# EAGLE design current_measure (EAGLE 6.4)
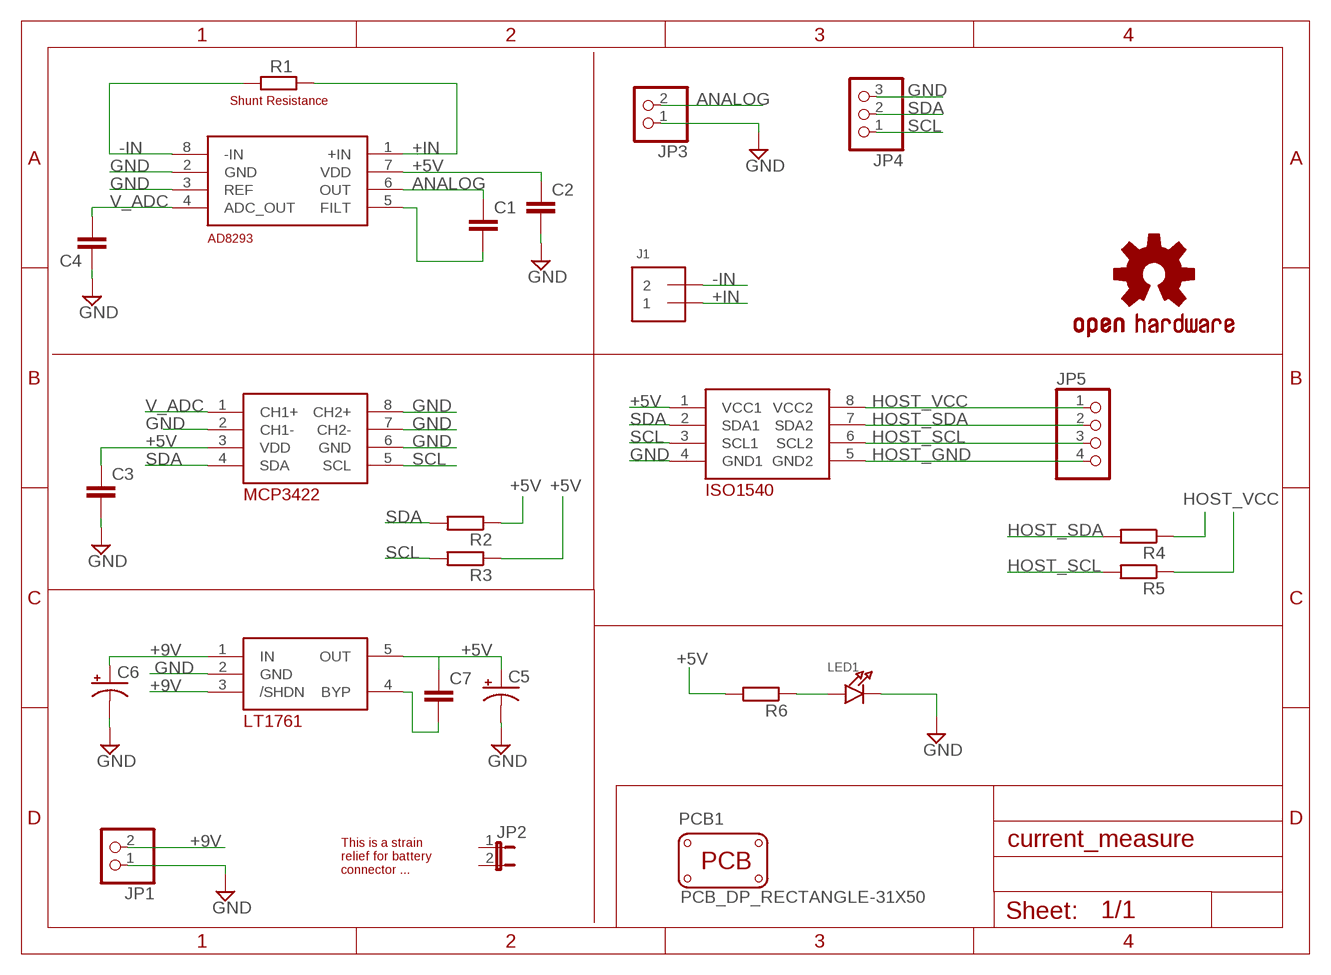
[diagram p0: schematic, sheet 1]

## Parts
C1  C-EUC0603  [C0603]
C2  C-EUC0603  [C0603]
C3  C-EUC0603  [C0603]
C4  C-EUC0603  [C0603]
C5  CPOL-USC/6032-28R  [C/6032-28R]
C6  CPOL-USC/6032-28R  [C/6032-28R]
C7  C-EUC0603  [C0603]
J1  TERMBLOCK_1X2  [TERMBLOCK_1X2-3.5MM]
JP1  PINHD-1X2  [1X02]
JP2  JUMPER2  [JUMPER2]
JP3  PINHD-1X2  [1X02]
JP4  HEADER-1X3ROUND  [1X03_ROUND]
JP5  HEADER-1X4ROUND  [1X04_ROUND]
LED1  LED0805_NOOUTLINE  [CHIPLED_0805_NOOUTLINE]
LOGO1  OSHW-LOGOM  [OSHW-LOGO-M]
PCB1  PCB_DP_RECTANGLE-31X50  [DP5031_V1]
R1  R-EU_R1206  [R1206]
R2  R-EU_R0603  [R0603]
R3  R-EU_R0603  [R0603]
R4  R-EU_R0603  [R0603]
R5  R-EU_R0603  [R0603]
R6  R-EU_R0603  [R0603]
U$1  IHSAN_AD8293  [SOT23-8]
U$2  IHSAN_MCP3422  [SO08]
U$3  IHSAN_LT1761  [SOT23-5]
U$4  IHSAN_ISO1540  [SO08]

## Nets
+5V: C2.1 C3.1 C5.+ C7.1 R2.1 R3.1 R6.2 U$1.7(VDD) U$2.3(VDD) U$3.5(OUT) U$4.1(VCC1)
+9V: C6.+ JP1.2 U$3.1(IN) U$3.3(/SHDN)
+IN: J1.1 R1.2 U$1.1(+IN)
-IN: J1.2 R1.1 U$1.8(-IN)
ANALOG: C1.1 JP3.2 U$1.6(OUT)
GND: C2.2 C3.2 C4.1 C5.- C6.- JP1.1 JP3.1 JP4.3 LED1.C U$1.2(GND) U$1.3(REF) U$2.2(CH1-) U$2.6(GND) U$2.7(CH2-) U$2.8(CH2+) U$3.2(GND) U$4.4(GND1)
HOST_GND: JP5.4 U$4.5(GND2)
HOST_SCL: JP5.3 R5.2 U$4.6(SCL2)
HOST_SDA: JP5.2 R4.2 U$4.7(SDA2)
HOST_VCC: JP5.1 R4.1 R5.1 U$4.8(VCC2)
N$1: LED1.A R6.1
N$2: C7.2 U$3.4(BYP)
N$4: C1.2 U$1.5(FILT)
SCL: JP4.1 R3.2 U$2.5(SCL) U$4.3(SCL1)
SDA: JP4.2 R2.2 U$2.4(SDA) U$4.2(SDA1)
V_ADC: C4.2 U$1.4(ADC_OUT) U$2.1(CH1+)
Unconnected: JP2.1 JP2.2

## Notes on the sheet
- Shunt Resistance
- This is a strain
  relief for battery
  connector ...

## Library data of the parts
C1-C4 C7 = rcl:C-EU: CAPACITOR, European symbol
C5 C6 = rcl:CPOL-US: POLARIZED CAPACITOR, American symbol
J1 = microbuilder:TERMBLOCK_1X2: 3.5mm Terminal block http://www.ladyada.net/library/pcb/eaglelibrary.html
JP1 JP3 = pinhead:PINHD-1X2: PIN HEADER
JP2 = microbuilder:JUMPER2: JUMPER - 2 Pins
JP4 = microbuilder:HEADER-1X3: PIN HEADER
JP5 = microbuilder:HEADER-1X4: PIN HEADER
LED1 = microbuilder:LED: LED 0603 - 0603 Surface Mount Package 2mA: Green LED - Low Power (3.9mcd, 2ma, 1.7Vf) - Digikey: 475-2709-2-ND Orange LED - Low Power (9.8mcd, 2ma, 1.8Vf) - Digikey: 475-1194-2-ND Red LED - Low Power (5mcd, 2ma, 1.8Vf) - Digikey: 475-1195-2-ND Yellow LED - Low Power (7mcd, 2ma, 1.8Vf) - Digikey: 475-1196-2-ND 5mA: Blue LED - Low Power (17mcd, 5ma, 2.9Vf) - Digikey: LNJ937W8CRACT-ND 0805 - 0805 Surface Mount Package 2mA: Red LED (8.8mcd, 2mA, 1.8Vf, Clear) - Low Power [Digikey: 475-2510-1-ND] Green LED (5mcd, 2mA, 1.8Vf, Clear) - Low Power [Digikey: 475-2730-1-ND] Yellow LED (11.3mcd, 2mA, 1.8Vf, Clear) - Low Power [Digikey: 475-2555-1-ND] 20mA: Red LED (104mcd, 20mA, Diffused) - LS R976 [Digikey: 475-1278-6-ND] Red LED (12mcd, 20mA, 2.0Vf, Clear) - APT2012EC [Digikey: 754-1128-1-ND] Green LED (15mcd, 20mA, 2.2Vf, Clear) - APT2012GC [Digikey: 754-1131-1-ND] Orange LED (160mcd, 20mA, 2.1Vf, Clear) - APT2012SECK [Digikey: 754-1130-1-ND] 1206 - 1206 Surface Mount Package Green LED (26mcd, 20mA, Diffused) - LG N971 [Digikey: 475-1407-6-ND] Red LED (15mcd, 20mA, Diffused) - LH N974 [Digikey: 475-1416-6-ND]
LOGO1 = SparkFun-Aesthetics:OSHW-LOGO: Open Source Hardware Logo This logo indicates the piece of hardware it is found on incorporates a OSHW license and/or adheres to the definition of open source hardware found here: http://freedomdefined.org/OSHW
PCB1 = dp_devices:PCB_DP_RECTANGLE: Dangerous Prototypes Standard Rectangular PCB sizes
R1-R6 = rcl:R-EU_: RESISTOR, European symbol
U$1 = SparkFun-DigitalIC:IHSAN_AD8293
U$2 = SparkFun-DigitalIC:IHSAN_MCP3422
U$3 = SparkFun-DigitalIC:IHSAN_LT1761
U$4 = SparkFun-DigitalIC:IHSAN_ISO1540

## Board
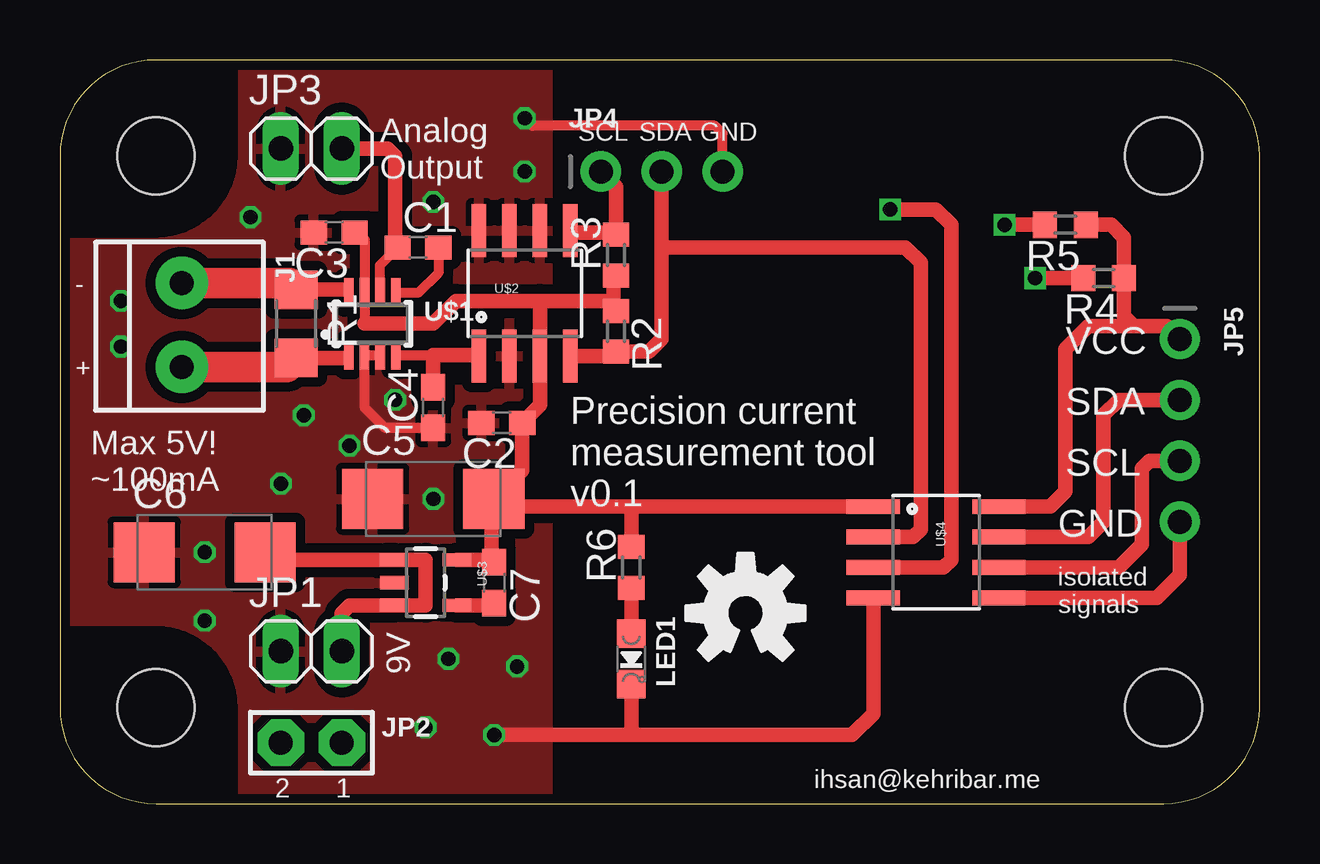
[diagram p1: board, top side]
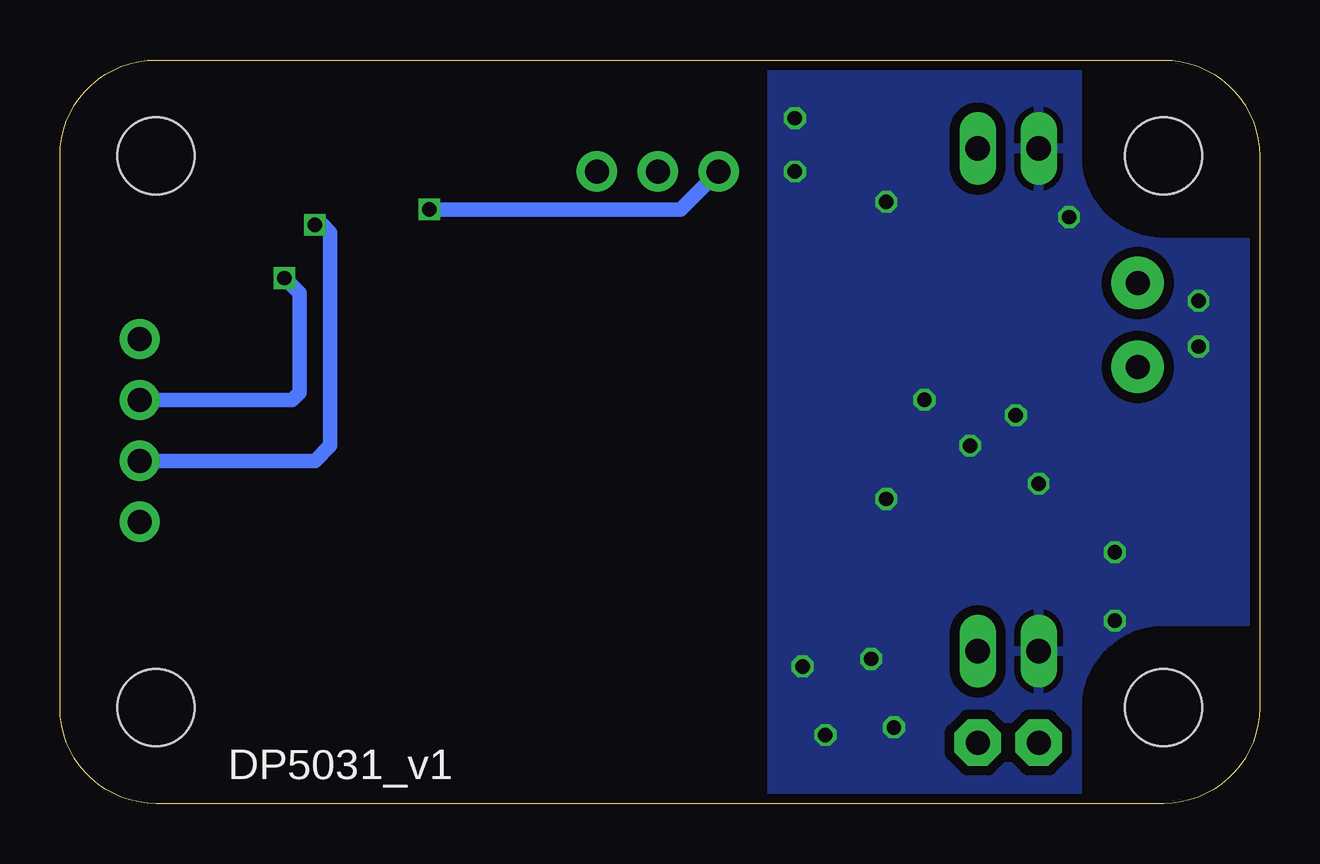
[diagram p2: board, bottom side, seen from below]

Size 50 x 31 mm. Coordinates in mm from the lower left corner, seen from the top.
Copper layers (1*16): Top 0.035mm / dielectric 1.5mm / Bottom 0.035mm
Design rules "Fusion_eagle_rule_v1.1": minimum track width 6mil, minimum drill 12mil, track to track 6mil, track to pad 6mil, pad to pad 6mil, via to via 6mil, smd to smd 0mil, copper to edge 10mil, drill to drill 10mil, minimum pad ring 10mil, minimum via ring 6mil, stop-mask expansion 2mil, vias tented up to drill 100mil, thermal gap 10mil

### Footprints (pad centres in the part's own frame; a part is rotated, then mirrored left to right if it is on the bottom)
C0603 = smd 1.1 x 1: 1 -0.85,0; 2 0.85,0
C/6032-28R = smd 2.55 x 2.5: + 2.525,0; - -2.525,0
TERMBLOCK_1X2-3.5MM = drill 1 pad 2.184: 1 1.8,0; 2 -1.7,0
1X02 = drill 1.016 long: 1 -1.27,0; 2 1.27,0
JUMPER2 = drill 1 pad 1.93 octagon: 1 2.54,0; 2 0,0
1X03_ROUND = drill 1 pad 1.676: 1 -2.54,0; 2 0,0; 3 2.54,0
1X04_ROUND = drill 1 pad 1.676: 1 -3.81,0; 2 -1.27,0; 3 1.27,0; 4 3.81,0
CHIPLED_0805_NOOUTLINE = smd 1.2 x 1.2: A 0,-1.05; C 0,1.05
DP5031_V1 = hole 3.2: 4,4; 46,4; 46,27; 4,27
R1206 = smd 1.6 x 1.803: 1 -1.422,0; 2 1.422,0
R0603 = smd 1 x 1.1: 1 -0.85,0; 2 0.85,0
SOT23-8 = smd 0.4 x 1.2: 1 -0.975,-1.3; 2 -0.325,-1.3; 3 0.325,-1.3; 4 0.975,-1.3; 5 0.975,1.3; 6 0.325,1.3; 7 -0.325,1.3; 8 -0.975,1.3
SO08 = smd 0.61 x 2.21: 1 -1.905,-2.616; 2 -0.635,-2.616; 3 0.635,-2.616; 4 1.905,-2.616; 5 1.905,2.616; 6 0.635,2.616; 7 -0.635,2.616; 8 -1.905,2.616
SOT23-5 = smd 0.55 x 1.2: 1 -0.95,-1.3; 2 0,-1.3; 3 0.95,-1.3; 4 0.95,1.3; 5 -0.95,1.3

### Placement (x,y rotation side)
C1  14.92,23.18 0 top
C2  18.41,15.88 180 top
C3  11.43,23.81 180 top
C4  15.56,16.51 90 top
C5  15.56,12.7 0 top
C6  6.03,10.48 0 top
C7  18.1,9.21 270 top
J1  5.08,20 270 top
JP1  10.48,6.35 0 top
JP2  9.21,2.54 0 top
JP3  10.48,27.3 0 top
JP4  25.08,26.35 0 top
JP5  46.67,15.56 270 top
LED1  23.81,6.03 180 top
LOGO1  28.57,7.94 0 top
PCB1  0,0 0 top
R1  9.84,20 270 top
R2  23.18,19.68 270 top
R3  23.18,22.86 90 top
R4  43.5,21.91 180 top
R5  41.91,24.13 180 top
R6  23.81,9.84 90 top
U$1  13.02,20 0 top
U$2  19.37,21.27 0 top
U$3  15.24,9.21 270 top
U$4  36.51,10.48 270 top

### Tracks (layer width: path | path; a pad name or v marks a point on that pad's centre or on a via)
+5V
  Top 0.406: 12.69,20.01 U$1.7 12.7,23.5 12.38,23.81 C3.1 | 18,10.16 C7.1 | 18,12.62 C5.+ | 23.07,22.23 R3.1 | 23.07,20.95 23.07,20.64 R2.1 23.07,20.95
  Top 0.61: 12.69,20.01 13.34,20 15.56,20 16.51,20.95 20,20.95 | 20,20.95 U$2.3 20,16.61 C2.1 19.27,13.88 C5.+ 18.4,12.38 23.81,12.38 | U$3.5 18,10.16 18,12.62 | 23.07,22.23 23.07,20.95 20,20.95 | U$4.1 23.81,12.38 | R6.2 23.81,12.38
+9V
  Top 0.406: 13.62,10.16 U$3.1 | 13.62,8.26 U$3.3 | C6.+ 8.24,11.45 9.53,10.16
  Top 0.61: 13.62,10.16 15.24,10.16 15.24,8.26 13.62,8.26 | JP1.2 11.75,7.94 12.06,8.26 U$3.3 | 9.53,10.16 U$3.1
+IN
  Top 0.406: 11.92,18.58 U$1.1
  Top 0.61: R1.2 11.92,18.58
  Top 1.27: J1.1 9.46,18.2 R1.2
-IN
  Top 0.406: 11.92,21.42 U$1.8
  Top 0.61: 11.92,21.42 R1.1
  Top 1.27: J1.2 9.56,21.7 R1.1
ANALOG
  Top 0.406: U$1.6 13.34,22.45 C1.1 13.97,23.28
  Top 0.61: JP3.2 13.65,27.3 13.97,26.99 13.97,23.28
GND  (via drill 0.6)
  Top 0.406: C4.1 13.55,15.66 12.7,16.51 U$1.2 | U$1.2 | U$1.2 U$1.3 | JP4.3 27.62,27.94 27.3,28.26 19.68,28.26 v19.37,28.57
  Top 0.61: U$4.4 33.9,3.73 33.02,2.86 23.81,2.86 | 23.81,2.86 v18.1,2.86 | LED1.C 23.81,2.86
  other vias: 10.16,16.19 13.97,16.83 9.21,13.34 6.03,7.62 16.19,6.03 15.24,3.17 7.94,24.45 19.37,26.35 15.56,25.08 12.06,14.92 15.56,12.7 6.03,10.48 2.54,20.95 2.54,19.05 19.05,5.71
  pour Top (isolate 0.406): 0,31.11 20.32,31.11 20.32,0 0,0
  pour Bottom (isolate 0.406): 0,31.11 20.32,31.11 20.32,0 0,0
HOST_GND
  Top 0.61: U$4.5 45.72,8.57 46.67,9.53 JP5.4
HOST_SCL  (via drill 0.6)
  Top 0.61: U$4.6 44.13,9.84 45.09,10.79 45.09,13.97 45.4,14.29 JP5.3 | R5.2 v39.37,24.13
  Bottom 0.61: v39.37,24.13 39.05,24.13 38.73,23.81 38.73,14.92 39.37,14.29 JP5.3
HOST_SDA  (via drill 0.6)
  Top 0.61: U$4.7 42.86,11.11 43.5,11.75 43.5,16.19 44.13,16.83 JP5.2 | R4.2 v40.64,21.91
  Bottom 0.61: v40.64,21.91 40.01,21.27 40.01,17.14 40.32,16.83 JP5.2
HOST_VCC
  Top 0.61: 44.77,19.9 42.86,19.9 41.91,18.95 41.91,13.02 41.27,12.38 U$4.8 | 44.77,19.9 46.14,19.9 JP5.1 | R5.1 43.81,24.13 44.35,23.6 R4.1 44.35,20.32 44.77,19.9
N$1
  Top 0.61: LED1.A R6.1
N$2
  Top 0.406: 18,8.26 C7.2
  Top 0.61: U$3.4 18,8.26
N$4
  Top 0.406: U$1.5 14.95,21.3 15.77,22.12 C1.2
SCL  (via drill 0.6)
  Top 0.406: 21.35,23.81 U$2.5 | 22.96,23.81 R3.2 23.07,23.81
  Top 0.61: 21.35,23.81 23.07,23.81 | JP4.1 23.18,25.72 R3.2 | U$4.3 36.83,9.84 37.15,10.16 37.15,24.13 36.51,24.77 v34.61,24.77
  Bottom 0.61: v34.61,24.77 24.13,24.77 JP4.1
SDA
  Top 0.406: 23,18.66 R2.2
  Top 0.61: U$2.4 23,18.66 | JP4.2 25.08,23.18 | 25.08,23.18 25.08,19.37 24.55,18.84 R2.2 | U$4.2 35.56,11.11 35.88,11.43 35.88,22.54 35.24,23.18 25.08,23.18
V_ADC
  Top 0.406: U$1.4 15.56,18.7 | 17.42,18.7 U$2.1
  Top 0.61: 17.42,18.7 15.56,18.7 C4.2

### Text on the board
tPlace: SCL | SDA | GND | Analog / Output | - | VCC | + | SDA | SCL | Max 5V! / ~100mA | Precision current / measurement tool / v0.1 | GND | isolated / signals | 9V | ihsan@kehribar.me